# EasyEDA Pro project Car.eprj

# Schematic Schematic1
Board Name: Board1; Create Date: 2024-12-13; Page Name: P1; Project Name: Demo; Schematic Name: Schematic1; Update Date: 2024-12-13; Company: EasyEDA.com; Page Size: A4; Version: V1.0
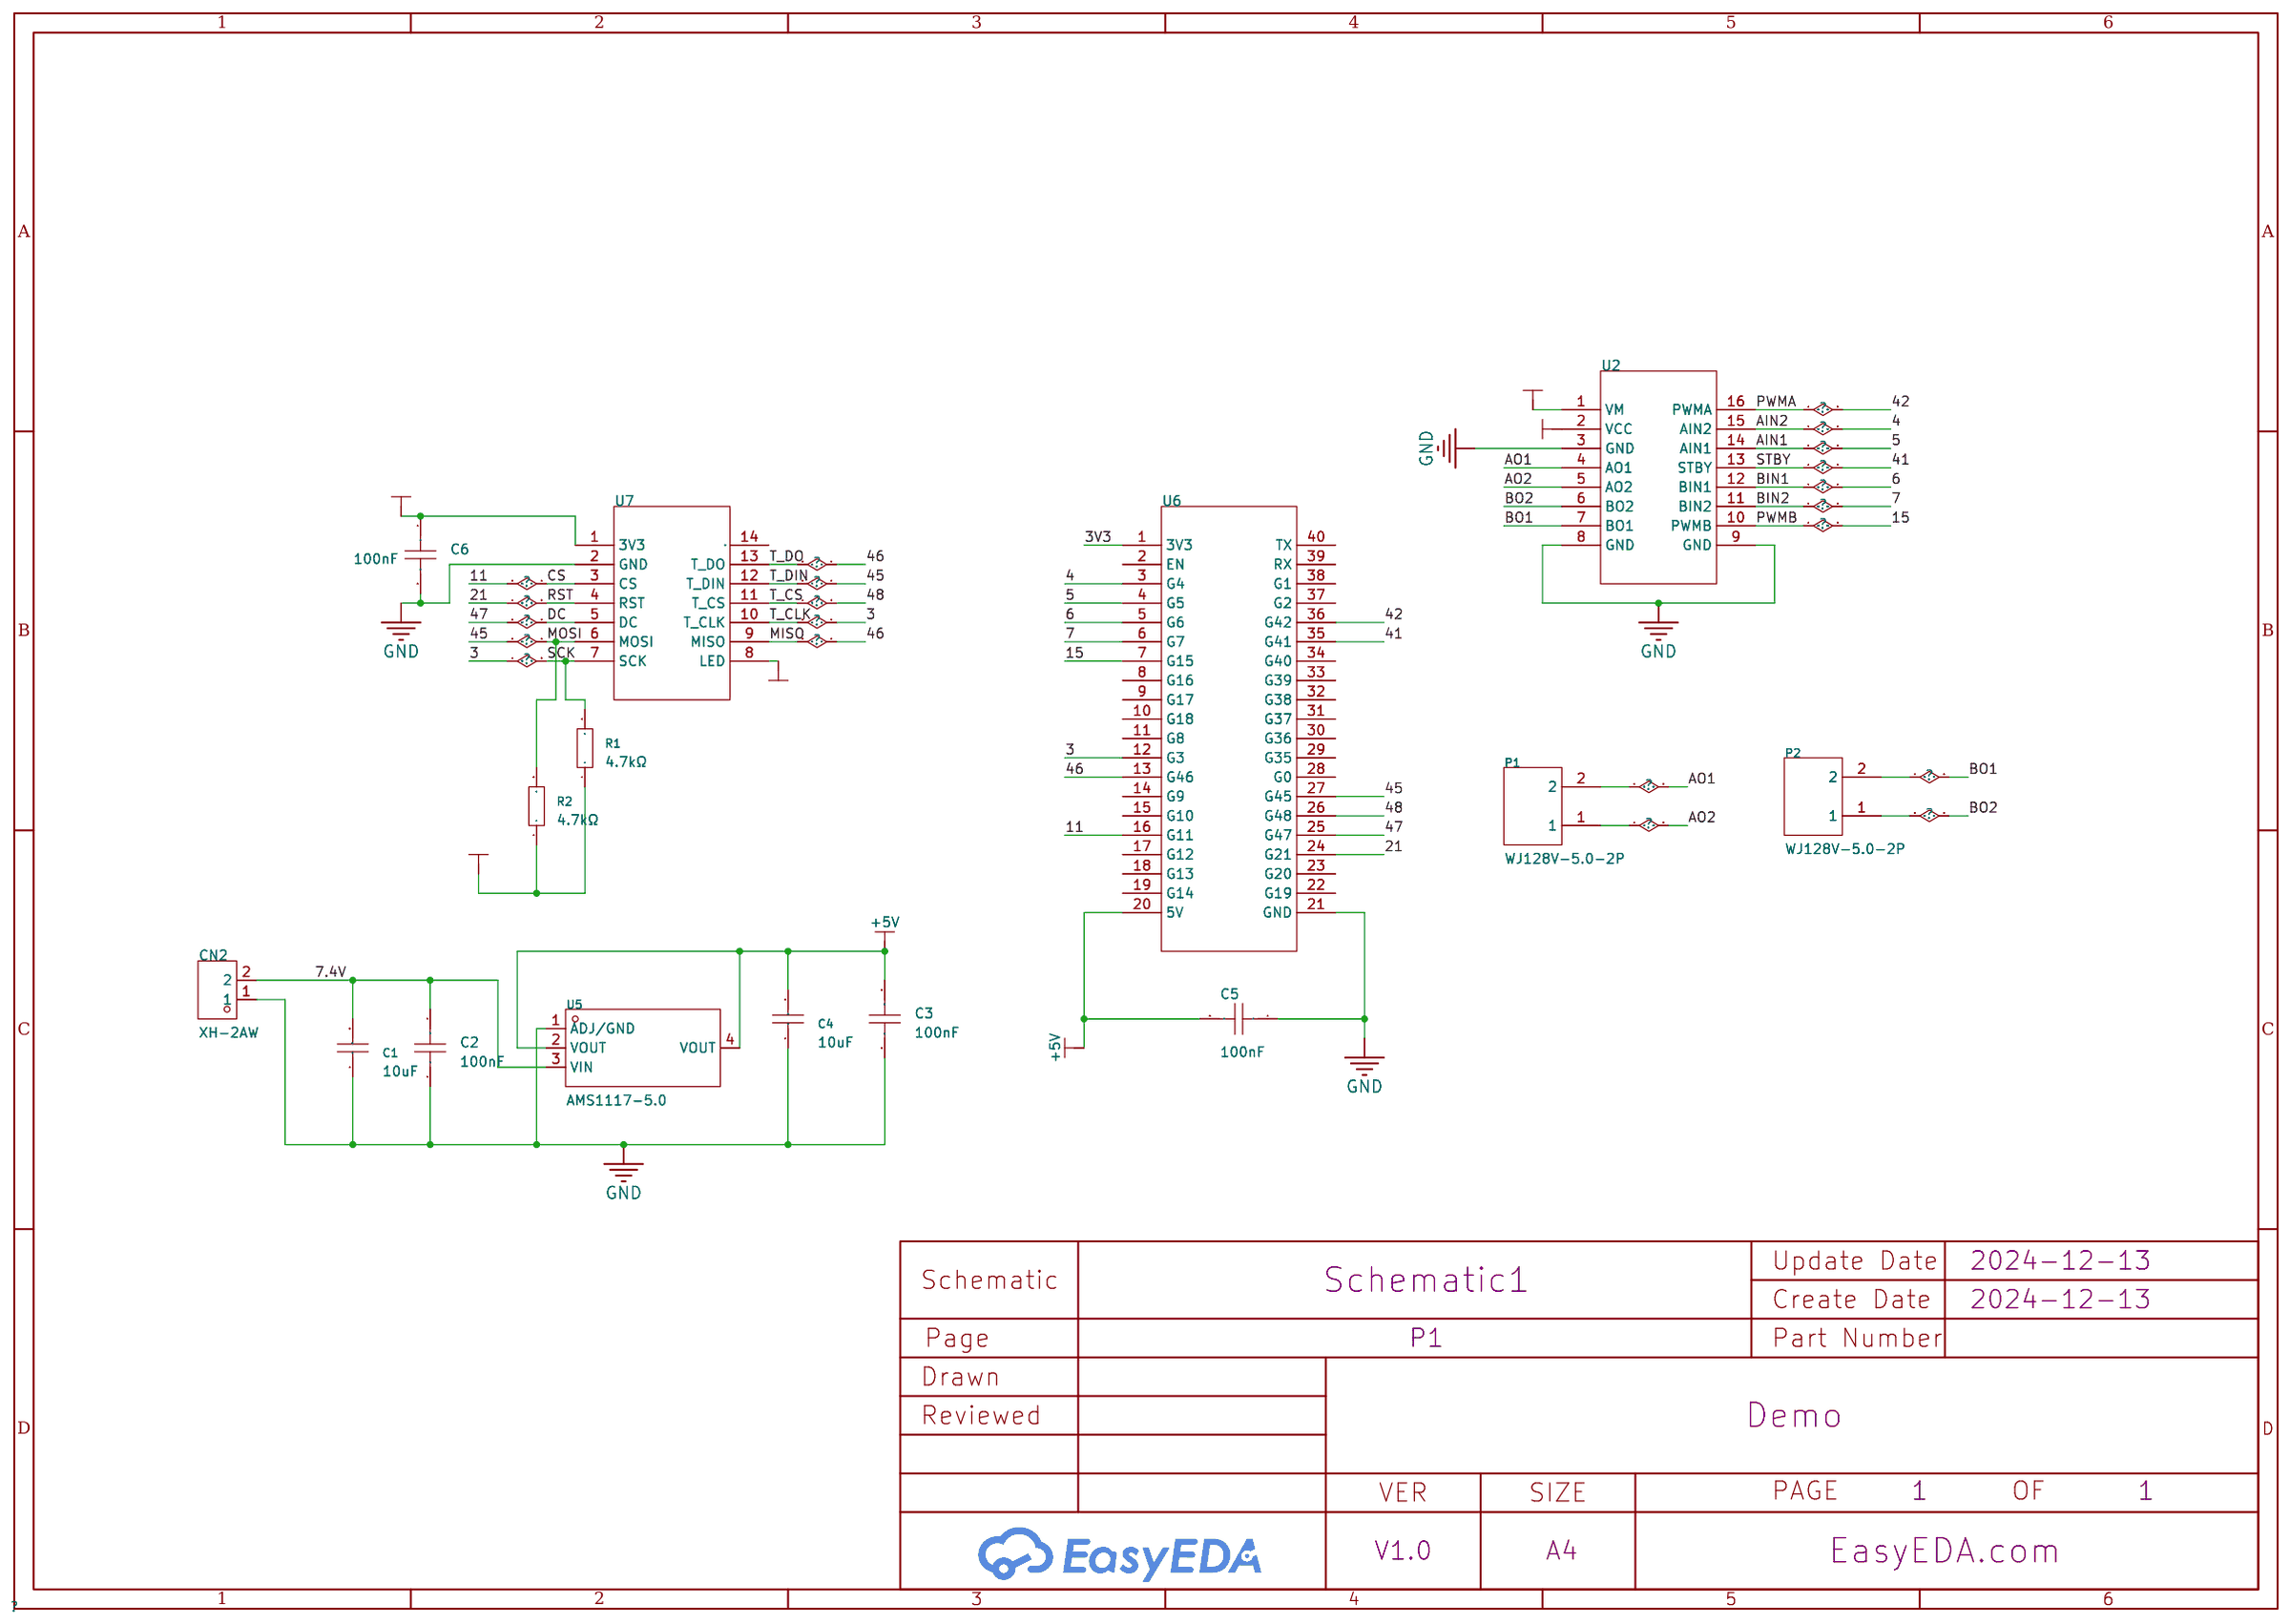
[diagram p0: schematic sheet]

## Parts
C1  10uF  [C0805]
C2  100nF  [C0603]
C3  100nF  [C0603]
C4  10uF  [C0805]
C5  100nF  [C0603]
C6  100nF  [C0603]
CN2  XH-2AW  [CONN-TH_2P-P2.50_XH-2AW]
P1  WJ128V-5.0-2P  [CONN-TH_2P-P5.00_WJ128V-5.0-2P]
P2  WJ128V-5.0-2P  [CONN-TH_2P-P5.00_WJ128V-5.0-2P]
R1  4.7kΩ  [R0603]
R2  4.7kΩ  [R0603]
U2  -  [6612FNG]
U5  AMS1117-5.0  [SOT-223-3_L6.7-W3.7-P2.30-LS7.0-BR]
U6  -  [ESP32S3]
U7  -  [ILI9341]

## Library data of the parts
C1 C4 = CL21A106KPFNNNE: LCSC Part Name: 10uF ±10% 10V; Supplier Part: C17024; Manufacturer: SAMSUNG(三星); Supplier Footprint: 0805; JLCPCB Part Class: Extended Part; Datasheet: https://atta.szlcsc.com/upload/public/pdf/source/20160218/1457707763339.pdf; Supplier: LCSC; Tolerance: ±10%
C2 C3 C5 C6 = CGA0603X7R104K500JT: LCSC Part Name: 100nF ±10% 50V; Supplier Part: C6119867; Manufacturer: HRE(芯声); Supplier Footprint: 0603; JLCPCB Part Class: Extended Part; Supplier: LCSC; Tolerance: ±10%; Voltage Rated: 50V
CN2 = XH-2AW_C2910520: Supplier Part: C2910520; Manufacturer: 韩国韩荣; Supplier Footprint: 弯插,P=2.5mm; JLCPCB Part Class: Extended Part; Datasheet: https://atta.szlcsc.com/upload/public/pdf/source/20211123/ADB0E2CEFE49A02C86C7257DAB53704B.pdf; Supplier: LCSC; Pins Structure: 1x2P; Pitch: 2.5mm; Mounting Style: Right-Angle; Reference Series: XH; Number of Pins: 2P; Number of Rows: 1; Number of PINs Per Row: 2; Operating Temperature Range: -25℃~+85℃
P1 P2 = WJ128V-5.0-2P: LCSC Part Name: 5mm 1x2P 排数:1 每排P数:2 直插; Supplier Part: C8269; Manufacturer: KANGNEX(康奈克斯电气); Supplier Footprint: 插件,P=5mm; JLCPCB Part Class: Extended Part; Datasheet: https://atta.szlcsc.com/upload/public/pdf/source/20191225/C8269_1FF44D6D2E83DB14A7CA266A410FD9AD.pdf; Supplier: LCSC; Structure: 1x2P; Pitch: 5mm; Color: Green; Mounting Style: Straight; Current Rating (Max): 20A; Voltage Rating (Max): 250V; Number of Pins: 2P; Number of Rows: 1; Wire Gauge - AWG: 12~22; Wire Gauge - mm2: 2.5; Number of PINs Per Row: 2; Operating Temperature Range: -40℃~+105℃
R1 R2 = RTT03472JTP: LCSC Part Name: 厚膜电阻 4.7kΩ ±5% 100mW; Supplier Part: C103662; Manufacturer: RALEC(旺诠); Supplier Footprint: 0603; JLCPCB Part Class: Extended Part; Datasheet: https://atta.szlcsc.com/upload/public/pdf/source/20191219/C158410_884373A5B7E1BC76BF57BC45A946C093.pdf; Supplier: LCSC; Type: Thick Film Resistors; Tolerance: ±5%; Temperature Coefficient: ±100ppm/℃; Operating Temperature Range: -55℃~+155℃
U2 = 6612FNG
U5 = AMS1117-5.0_C473812: LCSC Part Name: 输入18V 输出5V 0.8A; Supplier Part: C473812; Manufacturer: Slkor(萨科微); Supplier Footprint: SOT-223-3; JLCPCB Part Class: Extended Part; Datasheet: https://atta.szlcsc.com/upload/public/pdf/source/20201231/C426566_7F22DB93439D00F3FA27143E4F28C6AA.pdf; Supplier: LCSC; Maximum Input Voltage: 18V; Output Voltage: 5V; MAX Output Current: 800mA; Dropout Voltage: 1.5V@(1A); Output Polarity: Positive electrode; Number of Outputs: 1
U6 = ESP32S3
U7 = ILI9341

## Nets
3V3: C6.1 R1.1 R2.1 U2.2(VCC) U6.1(3V3) U7.1(3V3) U7.8(LED)
7.4V: C1.2 C2.2 CN2.2 U2.1(VM) U5.3(VIN)
+5V: C3.2 C4.2 C5.2 U5.2(VOUT) U5.4(VOUT) U6.20(5V)
GND: C1.1 C2.1 C3.1 C4.1 C5.1 C6.2 CN2.1 U2.3(GND) U2.8(GND) U2.9(GND) U5.1(ADJ/GND) U6.21(GND) U7.2(GND)
3: R1.2 U6.12(G3) U7.7(SCK) U7.10(T_CLK)
4: U2.15(AIN2) U6.3(G4)
5: U2.14(AIN1) U6.4(G5)
6: U2.12(BIN1) U6.5(G6)
7: U2.11(BIN2) U6.6(G7)
11: U6.16(G11) U7.3(CS)
15: U2.10(PWMB) U6.7(G15)
21: U6.24(G21) U7.4(RST)
41: U2.13(STBY) U6.35(G41)
42: U2.16(PWMA) U6.36(G42)
45: R2.2 U6.27(G45) U7.6(MOSI) U7.12(T_DIN)
46: U6.13(G46) U7.9(MISO) U7.13(T_DO)
47: U6.25(G47) U7.5(DC)
48: U6.26(G48) U7.11(T_CS)
AO1: P1.2 U2.4(AO1)
AO2: P1.1 U2.5(AO2)
BO1: P2.2 U2.7(BO1)
BO2: P2.1 U2.6(BO2)

Not connected (* = marked no-connect by the designer): U6 2(EN) 8(G16) 9(G17) 10(G18) 11(G8) 14(G9) 15(G10) 17(G12) 18(G13) 19(G14) 22(G19) 23(G20) 28(G0) 29(G35) 30(G36) 31(G37) 32(G38) 33(G39) 34(G40) 37(G2) 38(G1) 39(RX) 40(TX); U7 14

# Board PCB1
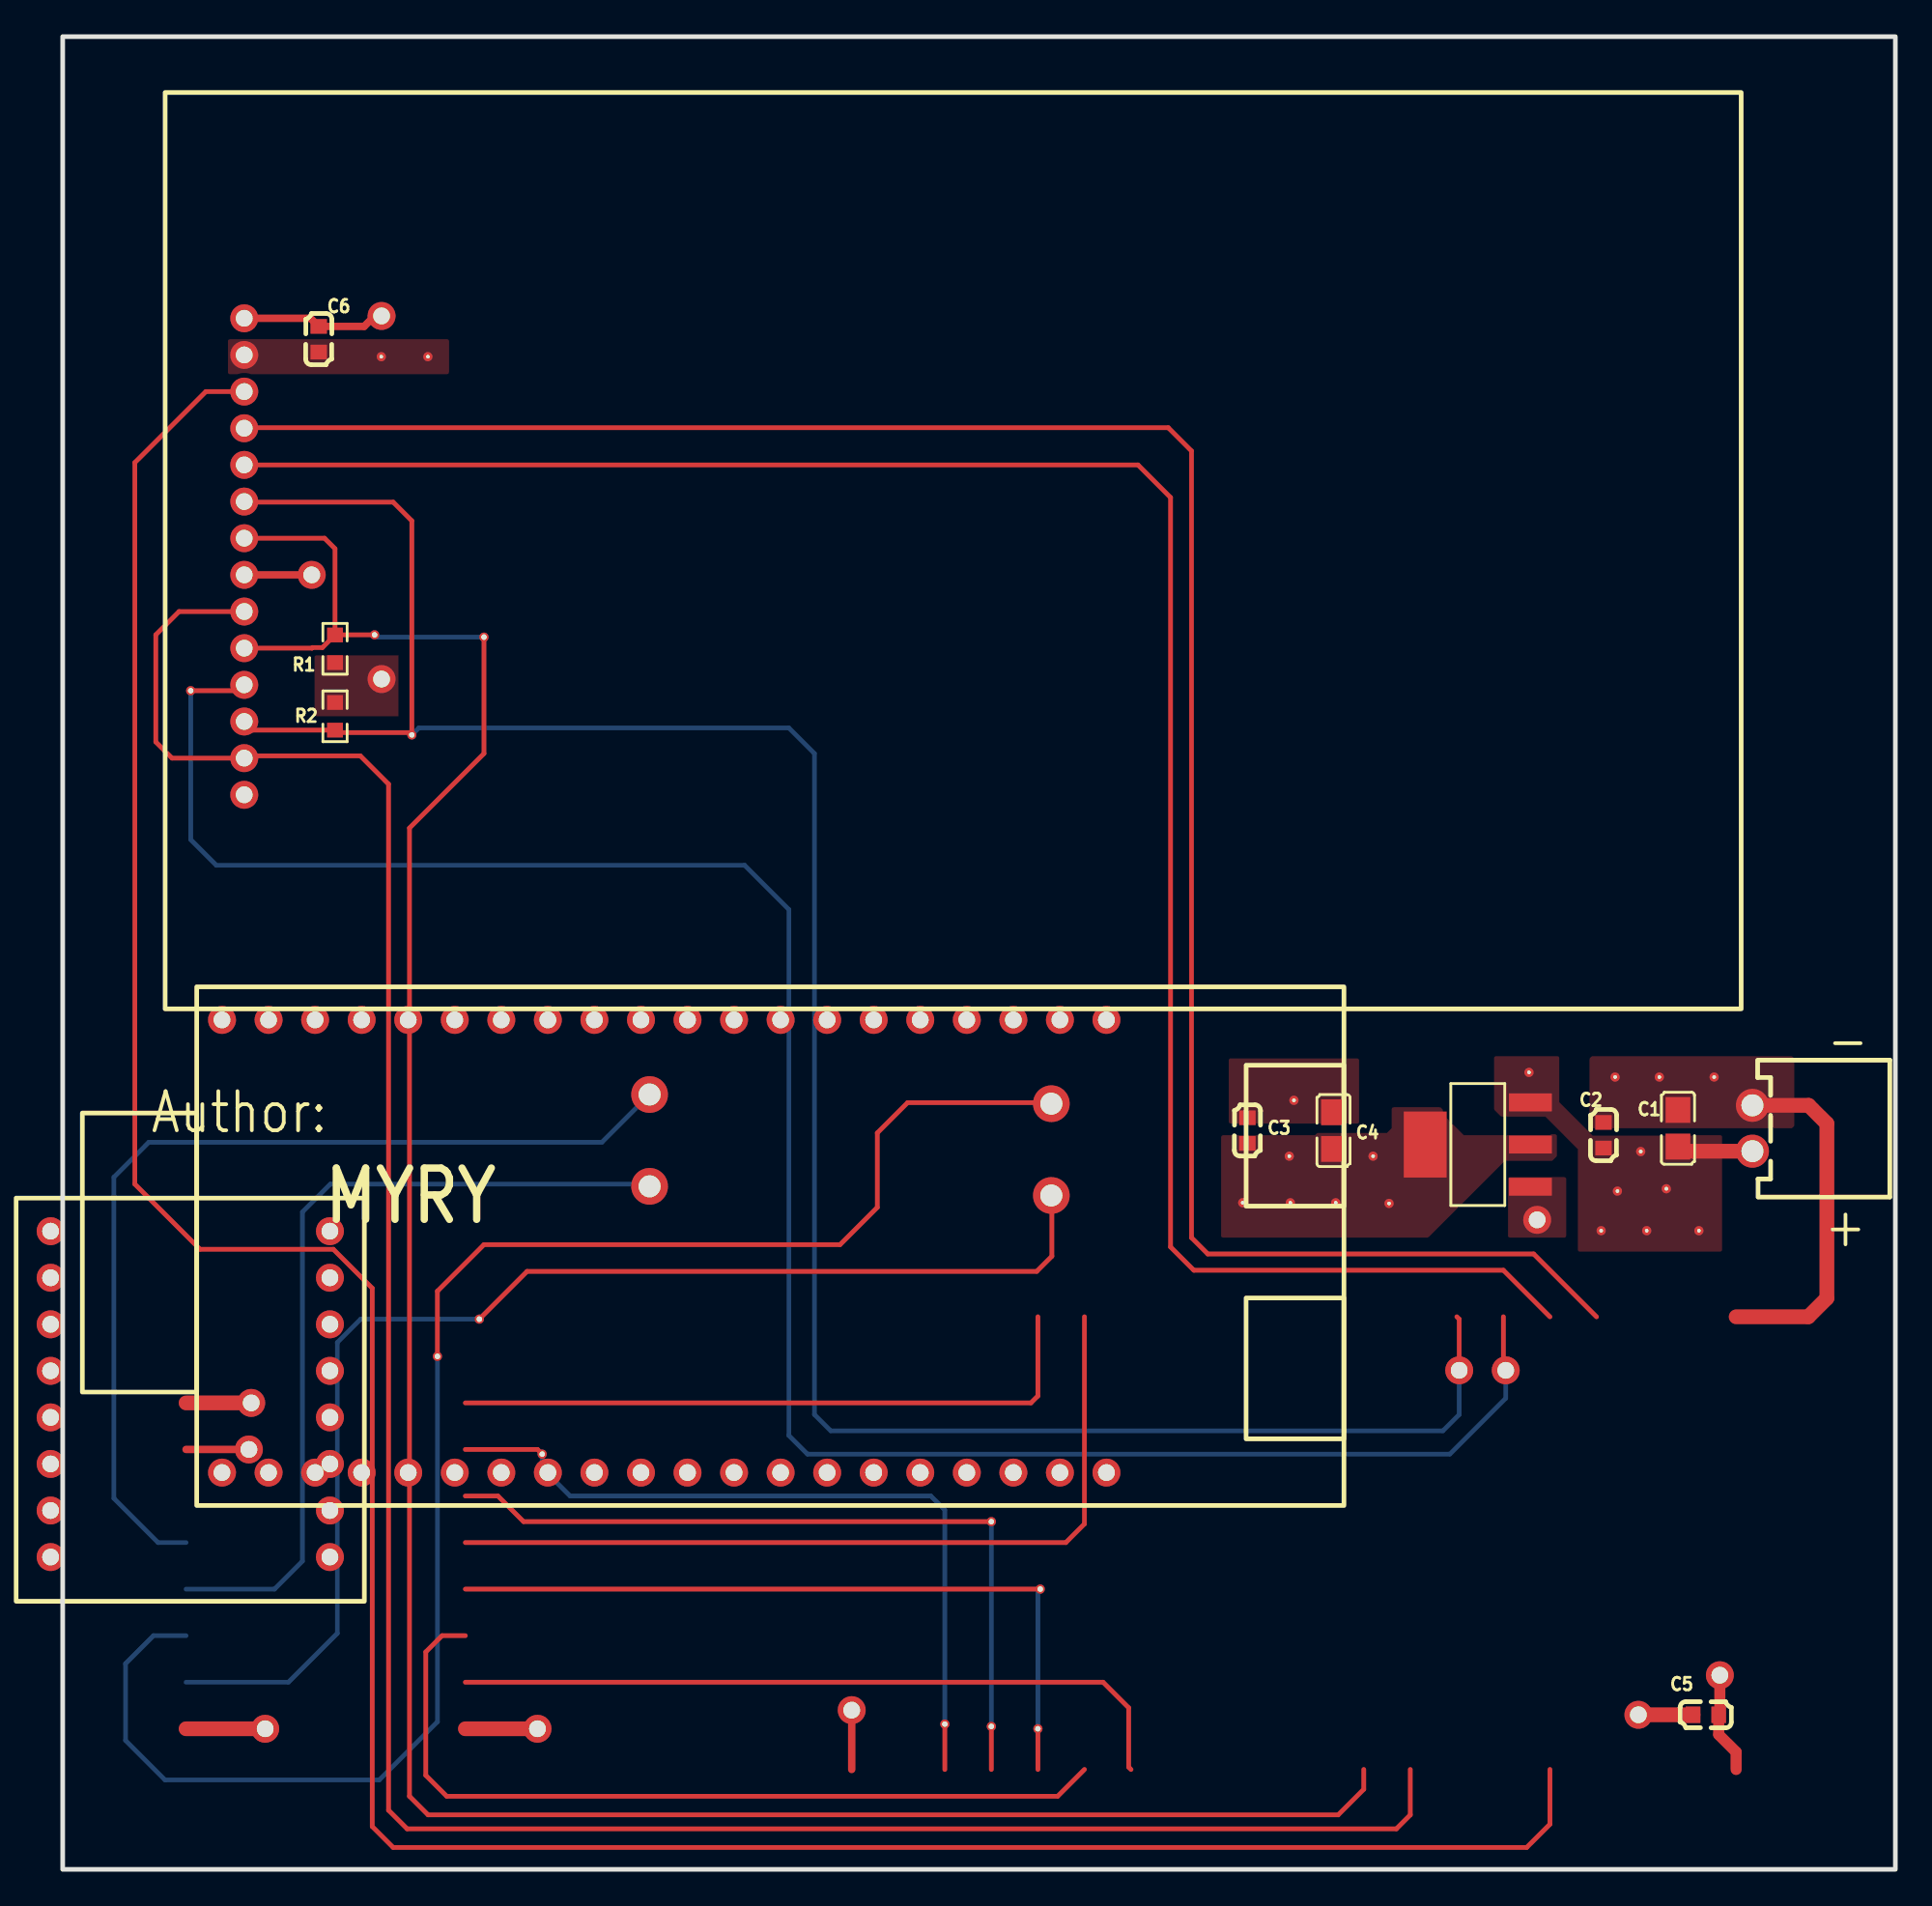
[diagram p1: board, top side]
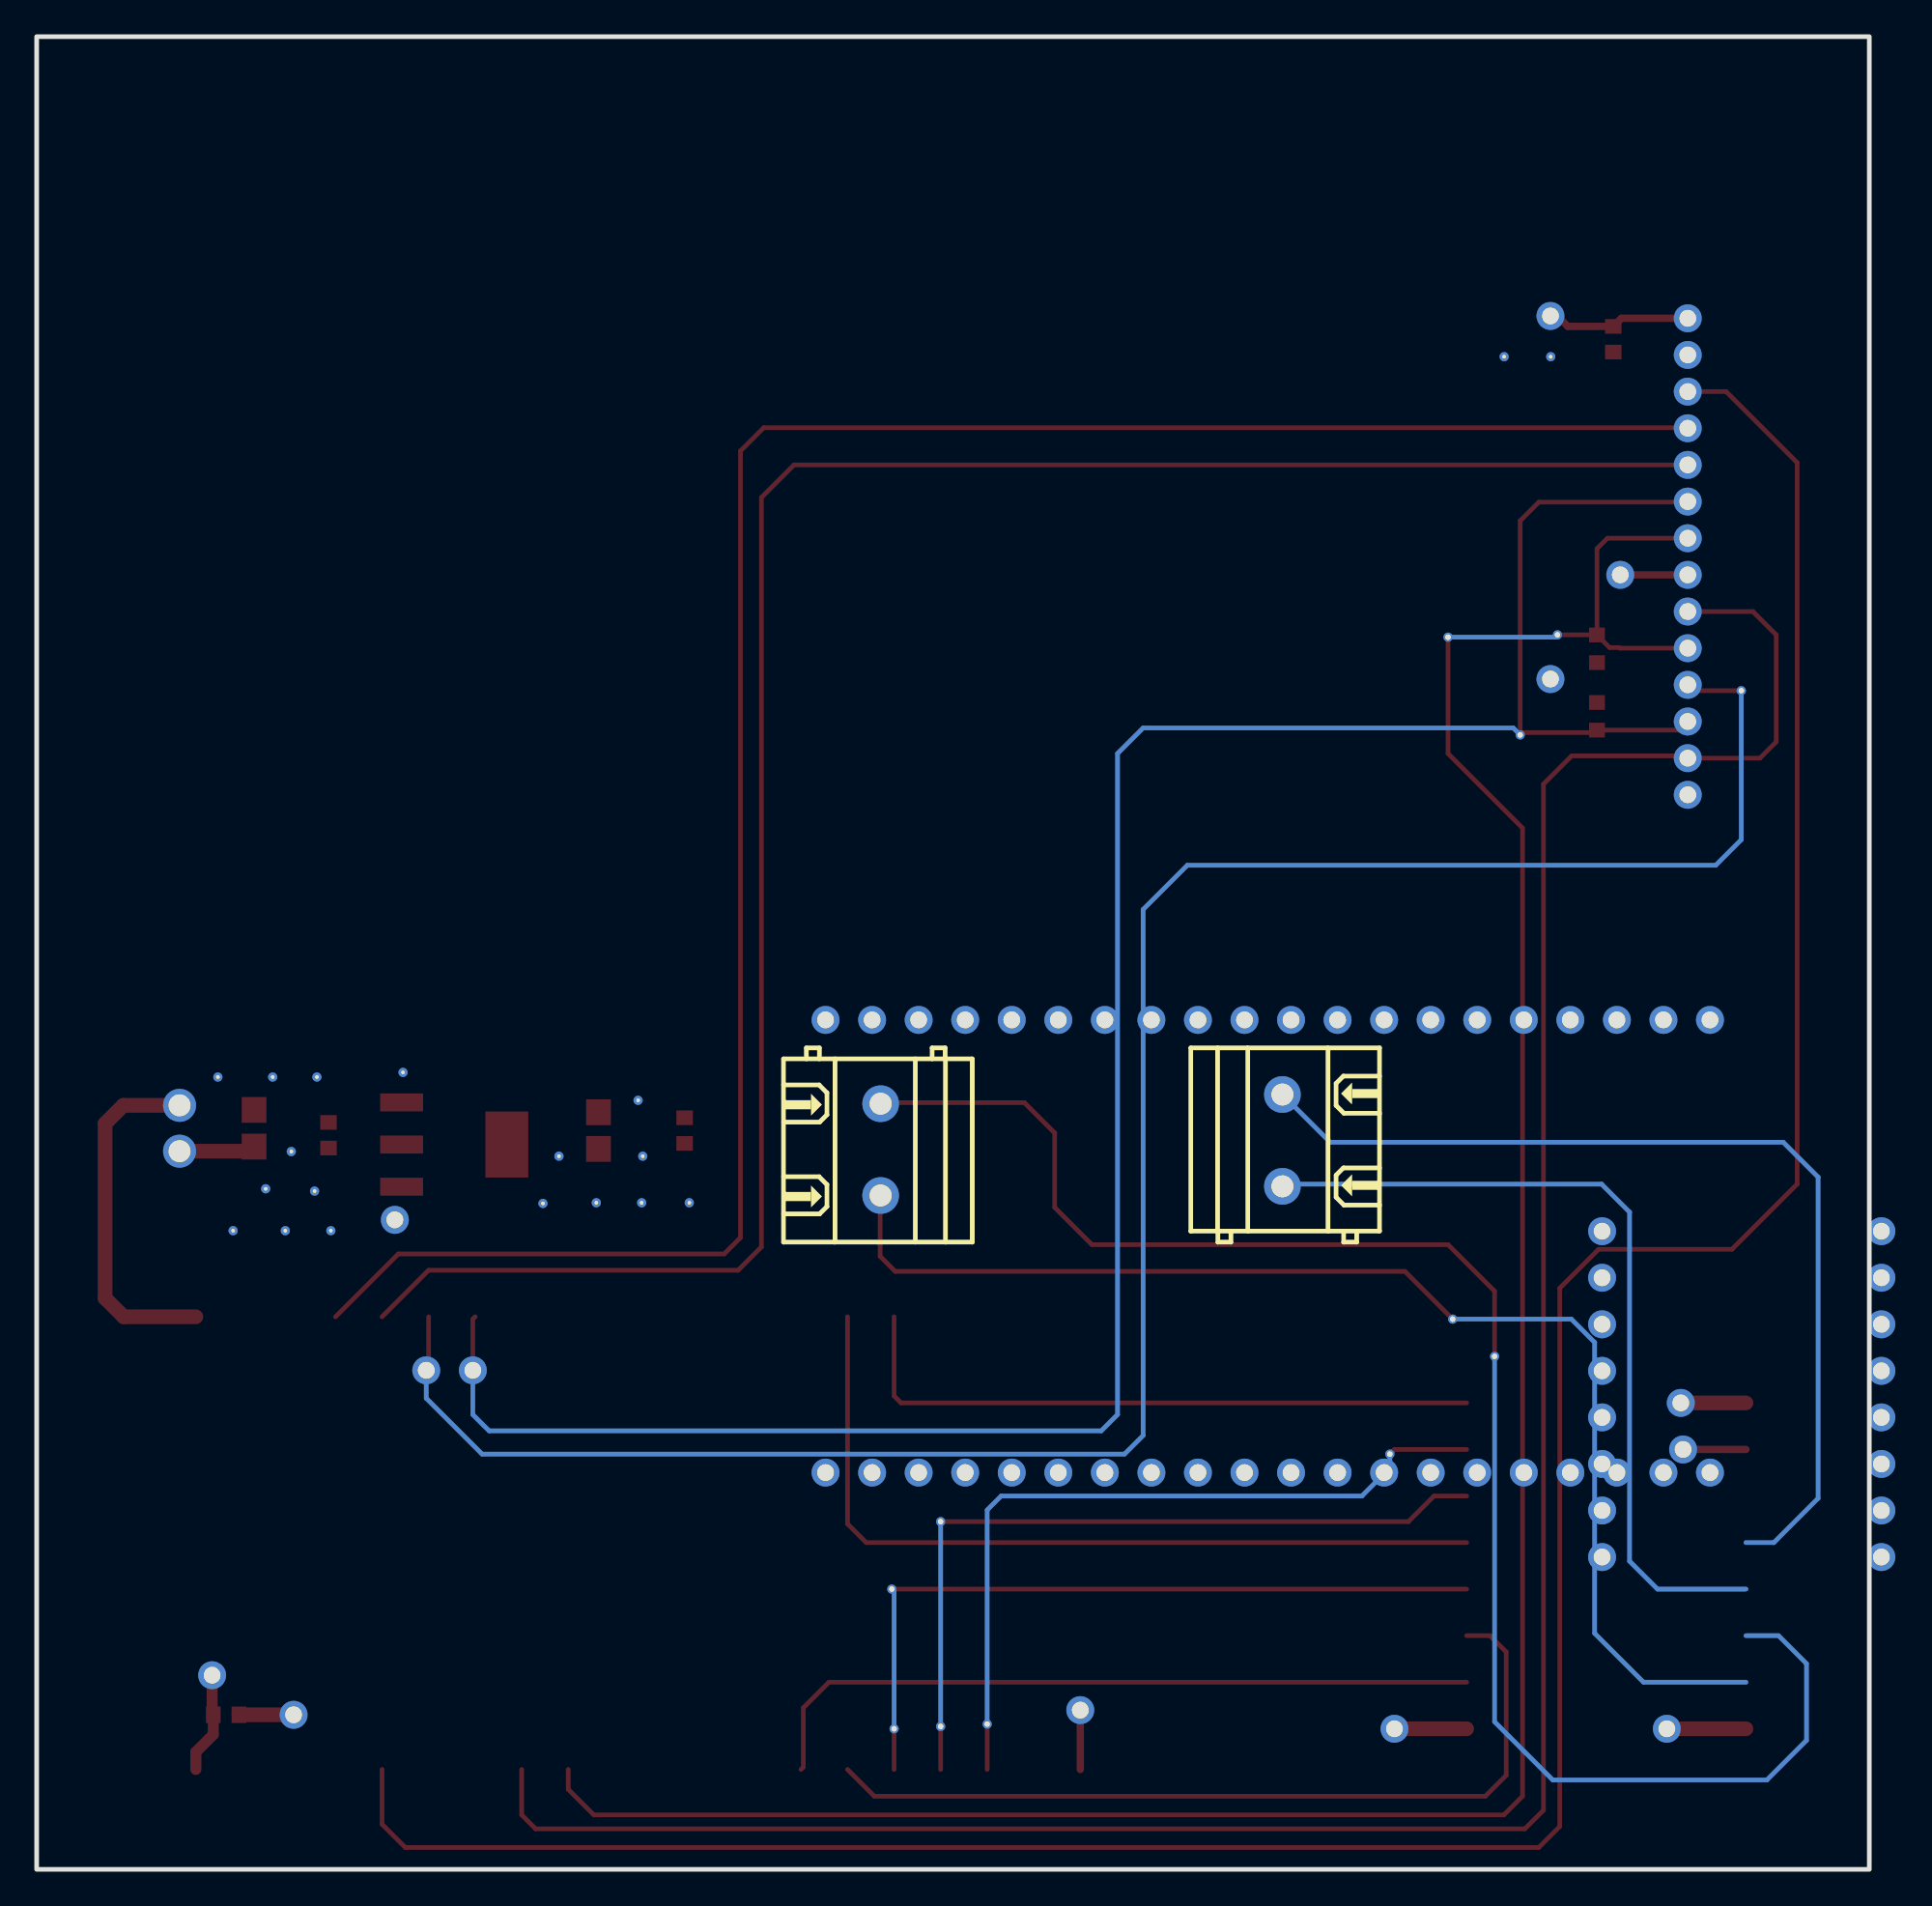
[diagram p2: board, bottom side, seen from below]

Outline 100 x 100 mm; copper layers: Top Layer, GND, PWR, Bottom Layer. Coordinates in mm from the lower left corner of the outline.
Outline path: rectangle 0,100 100,0
Stack: Top Layer 0.035mm Outer layer copper thickness 1oz / Dielectric1 0.2104mm 7628 RC49% 8.6mil / GND 0.0152mm Inner layer copper thickness / Dielectric2 1.065mm 1.1mm H/HOZ Copper / PWR 0.0152mm Inner layer copper thickness / Dielectric3 0.2104mm 7628 RC49% 8.6mil / Bottom Layer 0.035mm Outer layer copper thickness 1oz

## Design rules (mm)
template: 自定义配置
spacing copperThickness1oz (default): track to track 0.102, other pairs 0.152 to 0.3
spacing copperThickness2oz: track to track 0.203, other pairs 0.152 to 0.3
track width copperThickness1oz (default): min 0.127, default 0.254, max 2.54
track width copperThickness2oz: min 0.203, default 0.254, max 2.54
differential pair differentialPair (default): width min 0.127, default 0.254, max 2.54; gap min 0.152, default 0.152
via viaSize (default): diameter min 0.5, default 0.61, max 10; hole min 0.3, default 0.305, max 6.3

## Placement (name value [footprint] x y rotation side)
C1  10uF  [C0805]  88.14 40.44 270 top
C2  100nF  [C0603]  84.07 40.06 270 top
C3  100nF  [C0603]  64.64 40.31 270 top
C4  10uF  [C0805]  69.34 40.31 270 top
C5  100nF  [C0603]  89.66 8.43 0 top
C6  100nF  [C0603]  13.97 83.49 270 top
CN2  XH-2AW  [CONN-TH_2P-P2.50_XH-2AW]  92.2 40.44 270 top
NOREF  -  [Pad_e556]  67.18 41.96 0 top
NOREF#2  -  [Pad_e55]  66.93 38.91 0 top
NOREF#3  -  [Pad_e409]  50.67 7.8 0 top
NOREF#4  -  [Pad_e495]  84.71 43.23 0 top
NOREF#5  -  [Pad_e61]  83.95 34.85 0 top
NOREF#6  -  [Pad_e63]  89.28 34.85 0 top
NOREF#7  -  [Pad_e304]  19.05 61.9 0 top
NOREF#8  -  [Pad_e525]  17.02 67.36 0 top
NOREF#9  -  [Pad_e500]  17.38 82.54 0 top
NOREF#10  -  [Pad_e274]  78.74 27.23 0 top
NOREF#11  -  [Pad_e418]  26.16 22.66 0 top
NOREF#12  -  [Pad_e482]  25.91 7.67 0 top
NOREF#13  -  [Pad_e68]  72.37 36.34 0 top
NOREF#14  -  [Pad_e423]  50.67 18.97 0 top
NOREF#15  -  [Pad_e457]  20.45 27.99 0 top
NOREF#16  -  [Pad_e67]  69.46 36.37 0 top
NOREF#17  -  [Pad_e94]  90.42 10.59 0 top
NOREF#18  -  [Pad_e410]  53.21 7.67 0 top
NOREF#19  -  [Pad_e72]  84.84 37.01 0 top
NOREF#20  -  [Pad_e97]  43.05 8.69 0 top
NOREF#21  -  [Pad_e479]  11.05 7.67 0 top
NOREF#22  -  [Pad_e497]  90.11 43.23 0 top
NOREF#23  -  [Pad_e77]  10.29 25.45 0 top
NOREF#24  -  [Pad_e521]  22.99 67.23 0 top
NOREF#25  -  [Pad_e73]  87.5 37.14 0 top
NOREF#26  -  [Pad_e106]  13.59 70.63 0 top
NOREF#27  -  [Pad_e292]  6.98 64.31 0 top
NOREF#28  -  [Pad_e56]  71.5 38.91 0 top
NOREF#29  -  [Pad_e424]  53.34 15.29 0 top
NOREF#30  -  [Pad_e66]  66.99 36.37 0 top
NOREF#31  -  [Pad_e496]  87.12 43.23 0 top
NOREF#32  -  [Pad_e273]  76.2 27.23 0 top
NOREF#33  -  [Pad_e62]  86.43 34.85 0 top
NOREF#34  -  [Pad_e60]  80.01 43.49 0 top
NOREF#35  -  [Pad_e58]  86.11 39.17 0 top
NOREF#36  -  [Pad_e65]  64.39 36.37 0 top
NOREF#37  -  [Pad_e456]  22.73 30.02 0 top
NOREF#38  -  [Pad_e109]  17.4 64.95 0 top
NOREF#39  -  [Pad_e492]  80.45 35.44 0 top
NOREF#40  -  [Pad_e408]  48.13 7.93 0 top
NOREF#41  -  [Pad_e501]  19.93 82.54 0 top
NOREF#42  -  [Pad_e553]  85.98 8.43 0 top
NOREF#43  -  [Pad_e80]  10.16 22.91 0 top
NOREF#44  -  [Pad_e103]  17.4 84.76 0 top
P1  WJ128V-5.0-2P  [CONN-TH_2P-P5.00_WJ128V-5.0-2P]  32.02 39.77 90 bottom
P2  WJ128V-5.0-2P  [CONN-TH_2P-P5.00_WJ128V-5.0-2P]  53.95 39.27 270 bottom
R1  4.7kΩ  [R0603]  14.86 66.6 90 top
R2  4.7kΩ  [R0603]  14.86 62.92 270 top
U2  -  [6612FNG]  6.73 25.45 0 top
U5  AMS1117-5.0  [SOT-223-3_L6.7-W3.7-P2.30-LS7.0-BR]  77.22 39.55 0 top
U6  -  [ESP32S3]  43.05 30.15 90 top
U7  -  [ILI9341]  42.93 71.93 0 top

## Footprints (pads in the part's own frame, mm; a bottom-side part is the same pattern mirrored in y, then rotated)
6612FNG
  round 1.524 hole 0.914: 1(-7.39,9.37) 2(-7.39,6.83) 3(-7.39,4.29) 4(-7.39,1.75) 5(-7.39,-0.79) 6(-7.39,-3.33) 7(-7.39,-5.87) 8(-7.39,-8.41) 9(7.85,-8.41) 10(7.85,-5.87) 11(7.85,-3.33) 12(7.85,-0.79) 13(7.85,1.75) 14(7.85,4.29) 15(7.85,6.83) 16(7.85,9.37)
C0603
  rect 0.8x0.9 smd: 1(-0.7,0) 2(0.7,0)
C0805
  rect 1.41x1.35 smd: 1(-1,0) 2(1,0)
CONN-TH_2P-P2.50_XH-2AW
  round 1.8 hole 1.199: 1(-1.251,0) 2(1.251,0)
CONN-TH_2P-P5.00_WJ128V-5.0-2P
  round 2 hole 1.2: 1(-2.505,0) 2(2.505,0)
ESP32S3
  round 1.524 hole 0.914: 1(-8.5,34.36) 2(-8.5,31.82) 3(-8.5,29.28) 4(-8.5,26.74) 5(-8.5,24.2) 6(-8.5,21.66) 7(-8.5,19.12) 8(-8.5,16.58) 9(-8.5,14.04) 10(-8.5,11.5) 11(-8.5,8.96) 12(-8.5,6.42) 13(-8.5,3.88) 14(-8.5,1.34) 15(-8.5,-1.2) 16(-8.5,-3.74) 17(-8.5,-6.28) 18(-8.5,-8.82) 19(-8.5,-11.36) 20(-8.5,-13.9) 21(16.2,-13.9) 22(16.2,-11.36) 23(16.2,-8.82) 24(16.2,-6.28) 25(16.2,-3.74) 26(16.2,-1.2) 27(16.2,1.34) 28(16.2,3.88) 29(16.2,6.42) 30(16.2,8.96) 31(16.2,11.5) 32(16.2,14.04) 33(16.2,16.58) 34(16.2,19.12) 35(16.2,21.66) 36(16.2,24.2) 37(16.2,26.74) 38(16.2,29.28) 39(16.2,31.82) 40(16.2,34.36)
ILI9341
  round 1.524 hole 0.914: 1(-33.02,12.7) 2(-33.02,10.7) 3(-33.02,8.7) 4(-33.02,6.7) 5(-33.02,4.7) 6(-33.02,2.7) 7(-33.02,0.7) 8(-33.02,-1.3) 9(-33.02,-3.3) 10(-33.02,-5.3) 11(-33.02,-7.3) 12(-33.02,-9.3) 13(-33.02,-11.3) 14(-33.02,-13.3)
Pad_e55
  round 0.5 hole 0.2: 1(0,0)
Pad_e56
  round 0.5 hole 0.2: 2(0,0)
Pad_e58
  round 0.5 hole 0.2: 1(0,0)
Pad_e60
  round 0.5 hole 0.2: 1(0,0)
Pad_e61
  round 0.5 hole 0.2: 2(0,0)
Pad_e62
  round 0.5 hole 0.2: 3(0,0)
Pad_e63
  round 0.5 hole 0.2: 4(0,0)
Pad_e65
  round 0.5 hole 0.2: 1(0,0)
Pad_e66
  round 0.5 hole 0.2: 2(0,0)
Pad_e67
  round 0.5 hole 0.2: 3(0,0)
Pad_e68
  round 0.5 hole 0.2: 4(0,0)
Pad_e72
  round 0.5 hole 0.2: 8(0,0)
Pad_e73
  round 0.5 hole 0.2: 9(0,0)
Pad_e77
  round 1.524 hole 0.914: 1(0,0)
Pad_e80
  round 1.524 hole 0.914: 1(0,0)
Pad_e94
  round 1.524 hole 0.914: 1(0,0)
Pad_e97
  round 1.524 hole 0.914: 1(0,0)
Pad_e103
  round 1.524 hole 0.914: 1(0,0)
Pad_e106
  round 1.524 hole 0.914: 1(0,0)
Pad_e109
  round 1.524 hole 0.914: 1(0,0)
Pad_e273
  round 1.524 hole 0.914: 1(0,0)
Pad_e274
  round 1.524 hole 0.914: 2(0,0)
Pad_e292
  round 0.5 hole 0.3: 1(0,0)
Pad_e304
  round 0.5 hole 0.3: 1(0,0)
Pad_e408
  round 0.5 hole 0.3: 1(0,0)
Pad_e409
  round 0.5 hole 0.3: 2(0,0)
Pad_e410
  round 0.5 hole 0.3: 3(0,0)
Pad_e418
  round 0.5 hole 0.3: 1(0,0)
Pad_e423
  round 0.5 hole 0.3: 1(0,0)
Pad_e424
  round 0.5 hole 0.3: 2(0,0)
Pad_e456
  round 0.5 hole 0.3: 1(0,0)
Pad_e457
  round 0.5 hole 0.3: 2(0,0)
Pad_e479
  round 1.524 hole 0.914: 1(0,0)
Pad_e482
  round 1.524 hole 0.914: 1(0,0)
Pad_e492
  round 1.524 hole 0.914: 1(0,0)
Pad_e495
  round 0.5 hole 0.2: 1(0,0)
Pad_e496
  round 0.5 hole 0.2: 2(0,0)
Pad_e497
  round 0.5 hole 0.2: 3(0,0)
Pad_e500
  round 0.5 hole 0.2: 1(0,0)
Pad_e501
  round 0.5 hole 0.2: 2(0,0)
Pad_e521
  round 0.5 hole 0.3: 1(0,0)
Pad_e525
  round 0.5 hole 0.3: 1(0,0)
Pad_e553
  round 1.524 hole 0.914: 1(0,0)
Pad_e556
  round 0.5 hole 0.2: 1(0,0)
R0603
  rect 0.806x0.864 smd: 1(-0.753,0) 2(0.753,0)
SOT-223-3_L6.7-W3.7-P2.30-LS7.0-BR
  rect 2.34x0.98 smd: 1(2.87,-2.3) 2(2.87,0) 3(2.87,2.3)
  rect 2.34x3.6 smd: 4(-2.87,0)

## Nets
3V3: C6.1 NOREF#20.1 NOREF#26.1 NOREF#38.1 NOREF#43.1 NOREF#44.1 R1.1 R2.1 U2.2 U6.1 U7.1 U7.8
7.4V: C1.2 C2.2 CN2.2 NOREF#5.2 NOREF#6.4 NOREF#19.8 NOREF#23.1 NOREF#25.9 NOREF#33.3 NOREF#34.1 NOREF#35.1 U2.1 U5.3
+5V: C3.2 C4.2 C5.2 NOREF#2.1 NOREF#13.4 NOREF#16.3 NOREF#17.1 NOREF#28.2 NOREF#30.2 NOREF#36.1 U5.2 U5.4 U6.20
GND: C1.1 C2.1 C3.1 C4.1 C5.1 C6.2 CN2.1 NOREF.1 NOREF#4.1 NOREF#9.1 NOREF#12.1 NOREF#21.1 NOREF#22.3 NOREF#31.2 NOREF#39.1 NOREF#41.2 NOREF#42.1 U2.3 U2.8 U2.9 U5.1 U6.21 U7.2
3: NOREF#8.1 NOREF#24.1 R1.2 U6.12 U7.7 U7.10
4: NOREF#11.1 NOREF#40.1 U2.15 U6.3
5: NOREF#3.2 NOREF#14.1 U2.14 U6.4
6: NOREF#18.3 NOREF#29.2 U2.12 U6.5
7: U2.11 U6.6
11: U6.16 U7.3
15: U2.10 U6.7
21: U6.24 U7.4
41: U2.13 U6.35
42: U2.16 U6.36
45: NOREF#7.1 NOREF#32.1 R2.2 U6.27 U7.6 U7.12
46: U6.13 U7.9 U7.13
47: U6.25 U7.5
48: NOREF#10.2 NOREF#27.1 U6.26 U7.11
AO1: P1.2 U2.4
AO2: P1.1 U2.5
BO1: NOREF#37.1 P2.2 U2.7
BO2: NOREF#15.2 P2.1 U2.6

Pads without a net: U6 2 8 9 10 11 14 15 17 18 19 22 23 28 29 30 31 32 33 34 37 38 39 40; U7 14

## Routing (per net, layer and track width the routed paths; a pad name or vN(x,y) marks a point on that pad's centre or on a via; arc(x,y) is an arc through that point)
3V3: length 18.3
  Top Layer w0.4: U7.8 NOREF#26.1 ; U7.1 13.53,84.63 C6.1 16.45,84.19 17.02,84.76 NOREF#44.1 ; 43.05,5.45 NOREF#20.1 ; 6.73,22.91 NOREF#43.1
7.4V: length 7.7
  Top Layer w0.8: CN2.2 88.39,39.19 C1.2 ; 6.73,25.45 NOREF#23.1
+5V: length 5.6
  Top Layer w0.6: NOREF#17.1 90.42,8.5 C5.2 90.36,7.35 91.31,6.4 91.31,5.45
GND: length 30.6
  Top Layer w0.8: CN2.1 95.27,41.69 96.27,40.69 96.27,31.17 95.25,30.15 91.31,30.15 ; 21.97,7.67 NOREF#12.1 ; C5.1 NOREF#42.1 ; 6.73,7.67 NOREF#21.1
3: length 142.4
  Top Layer w0.254: U7.7 14.29,72.63 14.86,72.06 R1.2 ; R1.2 14.87,67.36 NOREF#8.1 ; R1.2 14.17,66.67 13.63,66.67 13.6,66.63 U7.10 ; 70.99,5.45 70.99,4.37 69.6,2.97 19.94,2.97 18.92,3.99 18.92,56.82 22.99,60.88 NOREF#24.1
  Bottom Layer w0.254: NOREF#8.1 17.14,67.23 NOREF#24.1
4: length 42.1
  Top Layer w0.254: NOREF#11.1 25.91,22.91 21.97,22.91 ; 48.13,5.45 NOREF#40.1
  Bottom Layer w0.254: NOREF#40.1 48.13,19.61 47.37,20.37 27.69,20.37 26.16,21.9 NOREF#11.1
5: length 42.8
  Top Layer w0.254: NOREF#14.1 25.15,18.97 23.75,20.37 21.97,20.37 ; 50.67,5.45 NOREF#3.2
  Bottom Layer w0.254: NOREF#3.2 NOREF#14.1
6: length 41.3
  Top Layer w0.254: 53.21,5.45 NOREF#18.3 ; NOREF#29.2 21.97,15.29
  Bottom Layer w0.254: NOREF#29.2 53.21,15.16 NOREF#18.3
7: length 46.3
  Top Layer w0.254: 21.97,12.75 20.7,12.75 19.81,11.86 19.81,5.13 20.95,3.99 54.29,3.99 55.75,5.45
11: length 159.9
  Top Layer w0.254: U7.3 7.81,80.63 3.94,76.76 3.94,37.39 7.49,33.83 14.77,33.83 16.89,31.71 16.89,2.34 18.03,1.19 79.88,1.19 81.15,2.46 81.15,5.45
15: length 40.2
  Top Layer w0.254: 21.97,10.21 56.77,10.21 58.17,8.81 58.17,5.58 58.29,5.45
21: length 119
  Top Layer w0.254: 83.69,30.15 80.26,33.58 62.48,33.58 61.6,34.47 61.6,77.39 60.33,78.66 9.94,78.66 U7.4
41: length 45.5
  Top Layer w0.254: 21.97,17.83 54.74,17.83 55.75,18.85 55.75,30.15
42: length 35.7
  Top Layer w0.254: 53.21,30.15 53.21,25.83 52.83,25.45 21.97,25.45
45: length 130.8
  Top Layer w0.254: U7.12 10.38,62.16 R2.2 14.99,62.03 18.92,62.03 NOREF#7.1 19.05,73.58 18.03,74.6 9.94,74.6 U7.6 ; NOREF#32.1 76.2,30.02 76.07,30.15
  Bottom Layer w0.254: NOREF#32.1 76.2,24.82 75.31,23.93 41.91,23.93 41.02,24.82 41.02,60.88 39.62,62.28 19.43,62.28 NOREF#7.1
46: length 139.9
  Top Layer w0.254: 73.53,5.45 73.53,2.97 72.77,2.21 18.8,2.21 17.78,3.23 17.78,59.22 16.24,60.76 10.03,60.76 U7.13 5.97,60.63 5.08,61.52 5.08,67.36 6.35,68.63 9.9,68.63 U7.9
47: length 114.5
  Top Layer w0.254: 9.91,76.63 58.67,76.63 60.45,74.85 60.45,33.96 61.72,32.69 78.61,32.69 81.15,30.15
48: length 119.5
  Top Layer w0.254: U7.11 9.59,64.31 NOREF#27.1 ; 78.61,30.15 78.61,27.1
  Bottom Layer w0.254: NOREF#10.2 78.74,25.71 75.69,22.66 40.64,22.66 39.62,23.67 39.62,52.38 37.21,54.79 8.38,54.79 6.98,56.19 NOREF#27.1
AO1: length 53.6
  Bottom Layer w0.254: P1.2 29.42,39.68 4.7,39.68 2.79,37.77 2.79,20.24 5.21,17.83 6.73,17.83
AO2: length 45.7
  Bottom Layer w0.254: P1.1 31.9,37.39 14.61,37.39 13.08,35.87 13.08,16.81 11.56,15.29 6.73,15.29
BO1: length 69.5
  Top Layer w0.254: NOREF#37.1 25.34,32.63 53.15,32.63 53.98,33.45 53.98,36.74 P2.2
  Bottom Layer w0.254: NOREF#37.1 16.26,30.02 14.99,28.75 14.99,12.88 12.32,10.21 6.73,10.21
BO2: length 91
  Top Layer w0.254: NOREF#15.2 20.45,31.55 22.99,34.09 42.42,34.09 44.45,36.12 44.45,40.18 46.1,41.83 53.89,41.83 P2.1
  Bottom Layer w0.254: 6.73,12.75 4.95,12.75 3.43,11.23 3.43,7.04 5.59,4.88 17.27,4.88 20.45,8.05 NOREF#15.2

## Copper pours and planes (outline as drawn; the poured copper is in the pictures)
3V3 on Top Layer: 13.72,66.24 18.32,66.24 18.32,62.92 13.72,62.92
3V3 on PWR: 8.89,23.55 8.89,13.39 14.73,7.54 14.73,3.23 43.31,3.23 44.58,4.5 44.58,9.58 44.2,9.96 38.73,9.96 37.21,8.43 37.21,5.51 17.78,5.51 17.02,6.27 17.02,8.69 11.18,14.53 11.18,23.8 11.05,23.93 10.67,23.55
3V3 on PWR: 16,86.03 16,84.13 16.38,83.74 21.59,83.74 21.59,73.71 21.34,73.46 13.72,73.46 12.7,72.44 12.7,64.19 12.57,64.06 12.57,55.42 9.53,52.38 5.21,52.38 1.78,48.95 1.78,34.72 1.65,34.6 1.65,22.4 2.29,21.77 11.68,21.77 11.68,23.67 4.19,23.67 3.94,23.93 3.94,47.71 5.93,49.71 9.91,49.71 12.83,52.63 13.72,52.63 16.89,55.8 16.89,62.28 18.8,64.19 18.8,65.71 18.54,65.96 14.58,65.96 14.2,66.34 14.2,69.06 16.69,71.55 22.86,71.55 22.86,73.46 23.37,73.97 23.37,85.01 22.35,86.03
7.4V on Top Layer: 89.04,40.04 83.49,40.04 81.66,41.87 81.66,44.37 78.11,44.37 78.11,41.45 78.49,41.07 80.9,41.07 82.68,39.29 82.68,33.71 90.55,33.71 90.55,40.06 89.06,40.06
7.4V on PWR: 81.66,42.85 81.66,48.31 5.08,48.31 5.08,25.07 5.21,24.94 7.58,24.69 11.3,24.69 11.43,24.82 11.43,41.2 13.84,43.61 77.93,43.61 78.69,42.85 81.66,42.85
+5V on Top Layer: 81.15,40.06 76.45,40.06 75.31,41.2 75.31,41.45 75.18,41.58 72.52,41.58 72.52,40.44 72.26,40.18 68.45,40.18 68.33,40.06 63.21,40.06 63.21,34.47 74.5,34.47 78.69,38.66 81.28,38.66 81.53,38.91 81.53,40.1 81.2,40.1
+5V on PWR: 63.24,38.02 63.24,32.31 63.25,32.31 93.22,32.31 93.73,31.8 93.73,17.07 89.65,13 89.65,6.76 90.93,5.48 90.93,4.24 93.09,4.24 96.27,7.42 96.27,33.06 96.01,33.33 76.58,33.33 73.41,36.5 73.41,37.64 63.62,37.64
GND on Top Layer: 83.31,44.25 83.31,40.56 83.44,40.44 94.36,40.44 94.49,40.56 94.49,44.25 94.36,44.37 83.44,44.37
GND on Top Layer: 63.63,44.37 63.63,40.69 70.74,40.69 70.74,44.25 63.75,44.25
GND on Top Layer: 78.87,37.77 78.87,34.47 82.04,34.47 82.04,37.77
GND on Top Layer: 9.02,83.49 9.02,81.59 21.08,81.59 21.08,83.49
GND on GND: -0.76,103.05 102.23,103.05 102.23,-4.52 -0.76,-4.52
GND on GND: -1.4,101.14 101.6,101.14 101.6,-6.43 -1.4,-6.43
GND on GND: -0.76,102.03 102.23,102.03 102.23,-5.54 -0.76,-5.54
GND on GND: -1.4,102.16 101.6,102.16 101.6,-5.41 -1.4,-5.41

## Text on the board
Top Silkscreen Layer: Author: | + | - | MYRY
